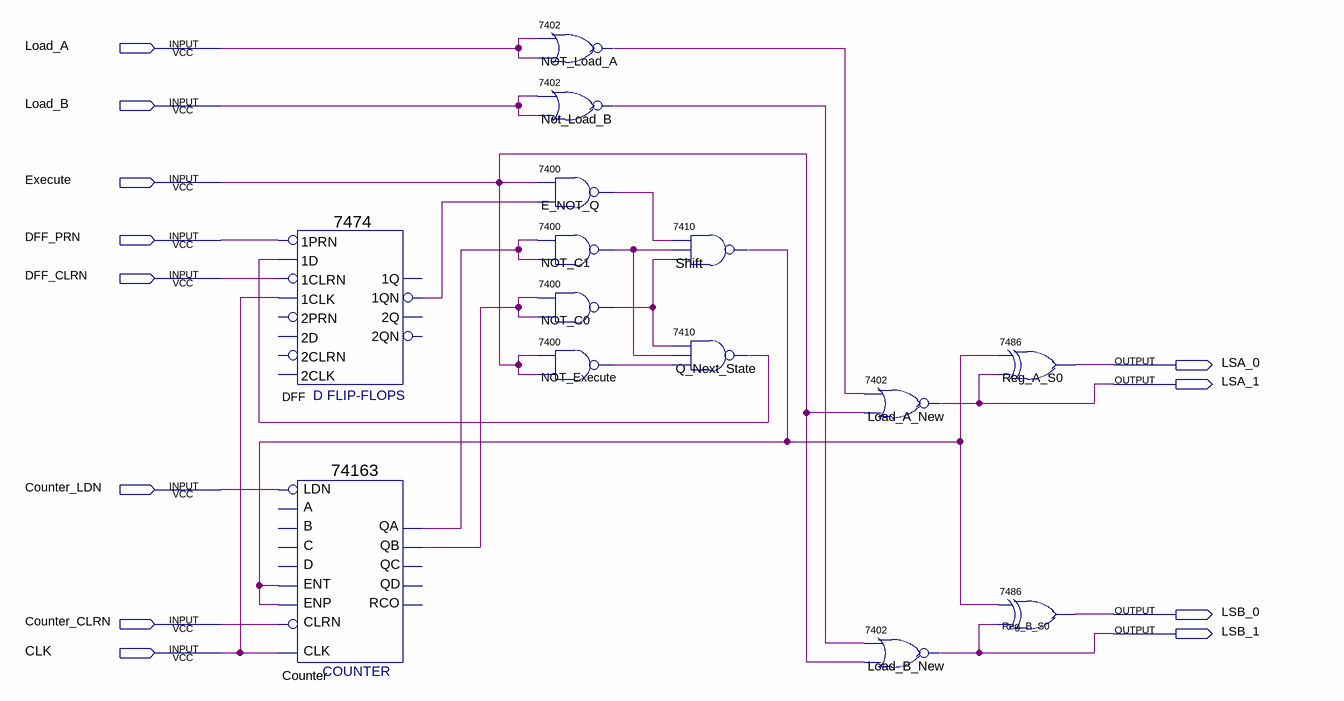
[diagram p0: schematic sheet]
// Quartus schematic 4-bit_logic_processor_schematic_control_unit.bdf as structural Verilog: 14 symbols, 12 pins
module \4-bit_logic_processor_schematic_control_unit  (
  input  Load_A,
  input  Load_B,
  input  Execute,
  input  DFF_PRN,
  input  DFF_CLRN,
  input  Counter_LDN,
  input  Counter_CLRN,
  input  CLK,
  output LSA_0,
  output LSA_1,
  output LSB_0,
  output LSB_1
);

  wire Counter_qa, Counter_qb, DFF_1qn, E_NOT_Q_1, NOT_C0_1, NOT_C1_1, NOT_Execute_1, NOT_Load_A_1,
       Not_Load_B_1, Q_Next_State_1, Shift_1;

  \7474  DFF (
    .\1CLK (CLK), .\1D (Q_Next_State_1), .\1PRN (DFF_PRN), .\1CLRN (DFF_CLRN), .\1QN (DFF_1qn));  // open: 2D, 2PRN, 2CLK, 2CLRN, 2Q, 2QN, 1Q
  \74163  Counter (
    .ENT(Shift_1), .CLRN(Counter_CLRN), .CLK(CLK), .ENP(Shift_1), .LDN(Counter_LDN), .QA(Counter_qa),
    .QB(Counter_qb));  // open: C, B, A, D, QC, QD, RCO
  \7402  NOT_Load_A (.\2 (Load_A), .\3 (Load_A), .\1 (NOT_Load_A_1));
  \7402  Not_Load_B (.\2 (Load_B), .\3 (Load_B), .\1 (Not_Load_B_1));
  \7400  E_NOT_Q (.\3 (DFF_1qn), .\2 (Execute), .\1 (E_NOT_Q_1));
  \7400  NOT_C1 (.\3 (Counter_qa), .\2 (Counter_qa), .\1 (NOT_C1_1));
  \7400  NOT_C0 (.\3 (Counter_qb), .\2 (Counter_qb), .\1 (NOT_C0_1));
  \7400  NOT_Execute (.\3 (Execute), .\2 (Execute), .\1 (NOT_Execute_1));
  \7410  Shift (.\2 (E_NOT_Q_1), .\3 (NOT_C1_1), .\4 (NOT_C0_1), .\1 (Shift_1));
  \7410  Q_Next_State (.\2 (NOT_C0_1), .\3 (NOT_C1_1), .\4 (NOT_Execute_1), .\1 (Q_Next_State_1));
  \7402  Load_A_New (.\2 (NOT_Load_A_1), .\3 (Execute), .\1 (LSA_1));
  \7402  Load_B_New (.\2 (Not_Load_B_1), .\3 (Execute), .\1 (LSB_1));
  \7486  Reg_A_S0 (.\2 (Shift_1), .\3 (LSA_1), .\1 (LSA_0));
  \7486  Reg_B_S0 (.\2 (Shift_1), .\3 (LSB_1), .\1 (LSB_0));
endmodule
